# EAGLE design twilight3 (EAGLE 7.5.0)
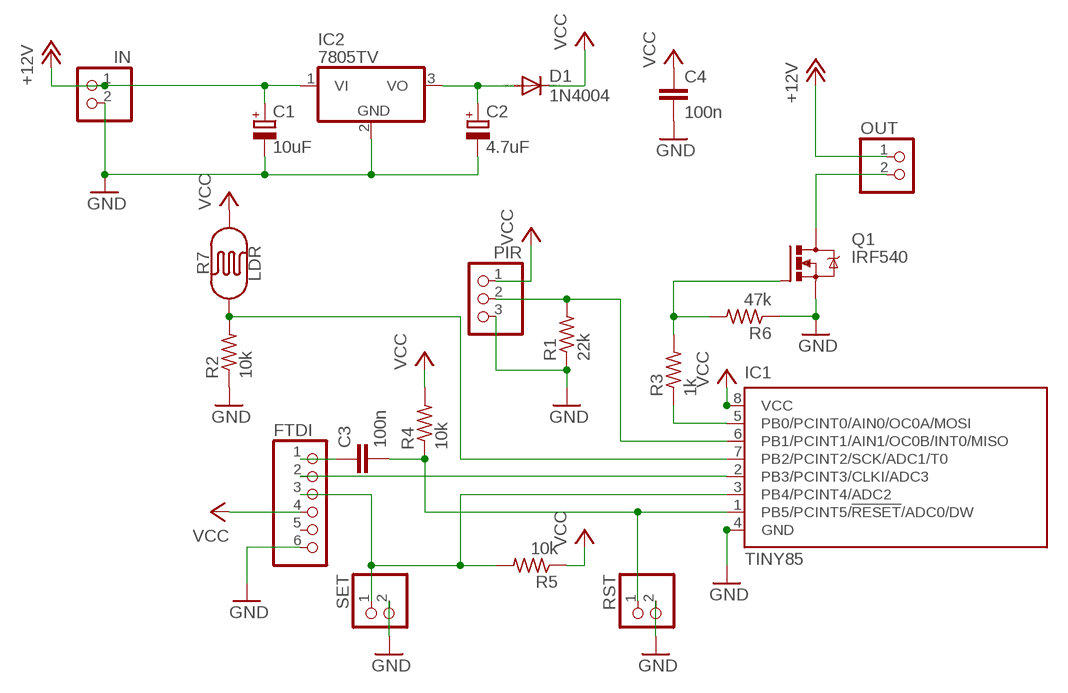
[diagram p0: schematic, sheet 1]

## Parts
C1  10uF  CPOL-EUE2-5  [E2-5]
C2  4.7uF  CPOL-EUE2-5  [E2-5]
C3  100n  C-EU050-024X044  [C050-024X044]
C4  100n  C-EU050-024X044  [C050-024X044]
D1  1N4004  [DO41-10]
FTDI  PINHD-1X6  [1X06]
IC1  TINY85  TINY13-20PU  [DIL08]
IC2  7805TV  [TO220V]
IN  PINHD-1X2  [1X02]
OUT  PINHD-1X2  [1X02]
PIR  PINHD-1X3  [1X03]
Q1  IRF540  [TO220BV]
R1  22k  R-US_0207/2V  [0207/2V]
R2  10k  R-US_0207/2V  [0207/2V]
R3  1k  R-US_0207/10  [0207/10]
R4  10k  R-US_0207/2V  [0207/2V]
R5  10k  R-US_0207/2V  [0207/2V]
R6  47k  R-US_0207/10  [0207/10]
R7  LDR  PHOTOCELLPTH  [PHOTOCELL]
RST  PINHD-1X2  [1X02]
SET  PINHD-1X2  [1X02]

## Nets
+12V: C1.+ IC2.1(VI) IN.1 OUT.1
GND: C1.- C2.- C4.2 FTDI.6 IC1.4(GND) IC2.2(GND) IN.2 PIR.3 Q1.S R1.1 R2.1 R6.1 RST.2 SET.2
GNDOUT: OUT.2 Q1.D
N$1: FTDI.2 IC1.2(PB3/PCINT3/CLKI/ADC3)
N$2: FTDI.3 IC1.3(PB4/PCINT4/ADC2) R5.2 SET.1
N$3: C3.2 IC1.1(PB5/PCINT5/!RESET!/ADC0/DW) R4.1 RST.1
N$4: IC1.7(PB2/PCINT2/SCK/ADC1/T0) R2.2 R7.1
N$5: IC1.5(PB0/PCINT0/AIN0/OC0A/MOSI) R3.1
N$6: Q1.G R3.2 R6.2
N$7: C3.1 FTDI.1
N$8: C2.+ D1.A IC2.3(VO)
N$9: IC1.6(PB1/PCINT1/AIN1/OC0B/INT0/MISO) PIR.2 R1.2
VCC: C4.1 D1.C FTDI.4 IC1.8(VCC) PIR.1 R4.2 R5.1 R7.2
Unconnected: FTDI.5

## Library data of the parts
C1 C2 = rcl:CPOL-EU: POLARIZED CAPACITOR, European symbol
C3 C4 = resistor:C-EU: CAPACITOR, European symbol
D1 = diode:1N4004: DIODE general purpose rectifier, 1 A
FTDI = pinhead:PINHD-1X6: PIN HEADER
IC1 = atmel:TINY13: 8-bit AVR Microcontroller with 1K Bytes In-System Programmable Flash Source: http://www.atmel.com/dyn/resources/prod_documents/2535S.pdf; MPN: ATTINY13-20PU; OC_FARNELL: 9171550; OC_NEWARK: 96K6521
IC2 = linear:78*: Positive VOLTAGE REGULATOR Source: http://cache.national.com/ds/LM/LM78L05.pdf http://www.fairchildsemi.com/ds/LM/LM7805.pdf
IN OUT RST SET = pinhead:PINHD-1X2: PIN HEADER
PIR = pinhead:PINHD-1X3: PIN HEADER
Q1 = transistor-power:IRF540: HEXFET Power MOSFET
R1-R6 = resistor:R-US_: RESISTOR, American symbol
R7 = SparkFun-Sensors:PHOTOCELL: Photocell (Photodetector, Photo Resistor, CdS) This is a very small light sensor. A photocell changes (also called a photodetector, photo resistor, CdS or photoconductive cell) resistance depending on the amount of light it is exposed to. These little sensors make great ambient light triggers (when light in the room turns on, do something). Datasheet <http://cdn.sparkfun.com/datasheets/Sensors/LightImaging/SEN-09088.pdf> SparkFun Products Mini Photocell <https://www.sparkfun.com/products/9088> (SEN-09088); PROD_ID: COMP-09129; SF_ID: SEN-09088

## Board
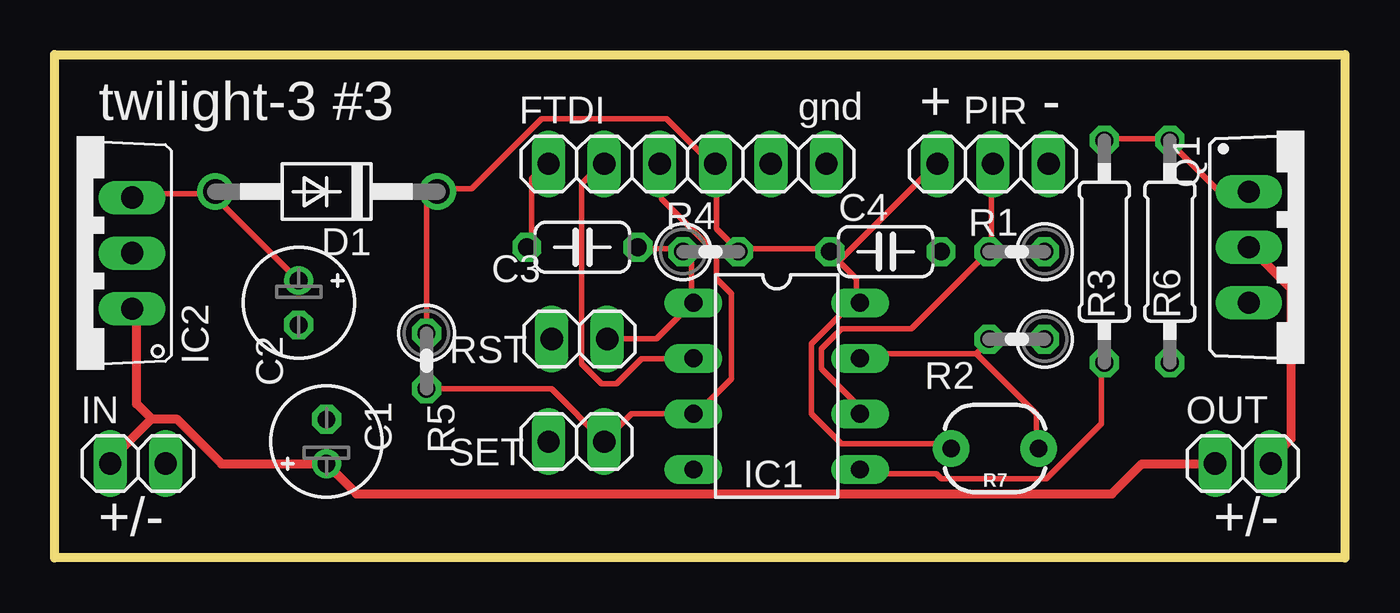
[diagram p1: board, top side]
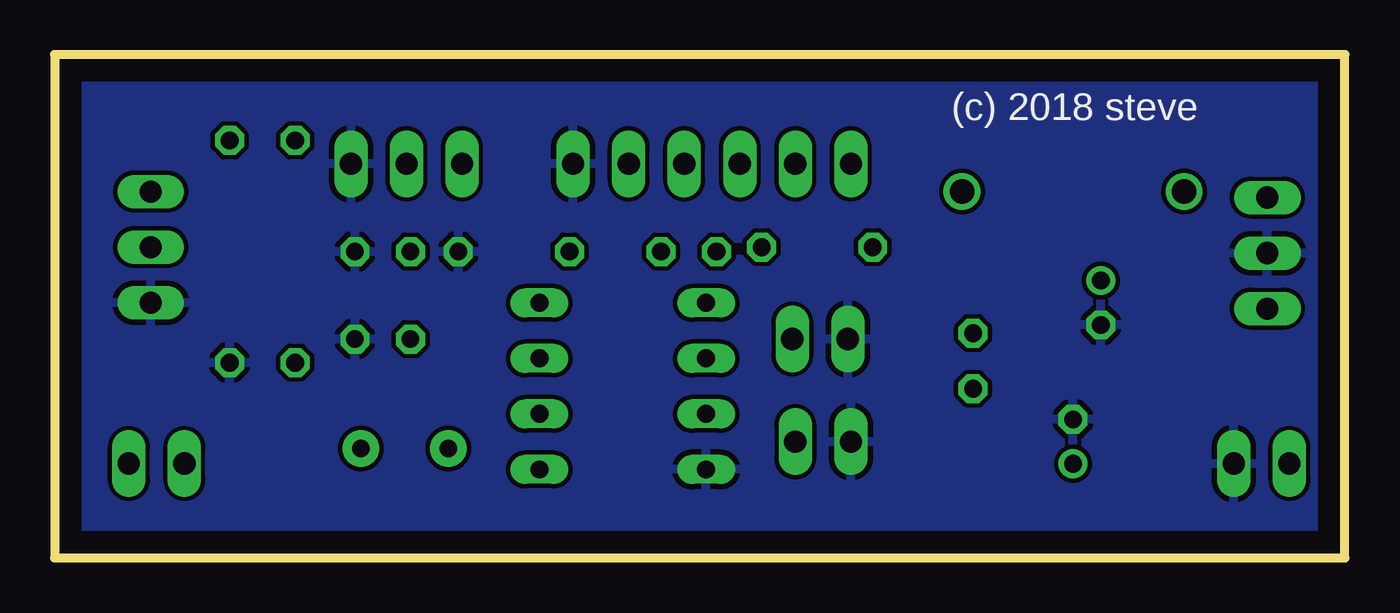
[diagram p2: board, bottom side, seen from below]

Size 59 x 23 mm. Coordinates in mm from the lower left corner, seen from the top.
Outline: 0,23 59,23 59,0 0,0 0,23
Copper layers (1*16): Top 0.035mm / dielectric 1.5mm / Bottom 0.035mm
Design rules "default": minimum track width 10mil, minimum drill 24mil, track to track 8mil, track to pad 8mil, pad to pad 8mil, via to via 8mil, smd to smd 8mil, copper to edge 40mil, drill to drill 8mil, minimum pad ring 10mil, minimum via ring 8mil, stop-mask expansion 4mil, vias tented up to drill 0mil, thermal gap 10mil

### Footprints (pad centres in the part's own frame; a part is rotated, then mirrored left to right if it is on the bottom)
E2-5 = drill 0.813 pad 1.27: + -1.016,0 | drill 0.813 pad 1.27 octagon: - 1.016,0
C050-024X044 = drill 0.813 octagon: 1 -2.54,0; 2 2.54,0
DO41-10 = drill 1.118: A 5.08,0; C -5.08,0
1X06 = drill 1.016 long: 1 -6.35,0; 2 -3.81,0; 3 -1.27,0; 4 1.27,0; 5 3.81,0; 6 6.35,0
DIL08 = drill 0.813 long: 1 -3.81,-3.81; 2 -1.27,-3.81; 3 1.27,-3.81; 4 3.81,-3.81; 5 3.81,3.81; 6 1.27,3.81; 7 -1.27,3.81; 8 -3.81,3.81
TO220V = drill 1.016 long: 1 -2.54,-2.54; 2 0,-2.54; 3 2.54,-2.54
1X02 = drill 1.016 long: 1 -1.27,0; 2 1.27,0
1X03 = drill 1.016 long: 1 -2.54,0; 2 0,0; 3 2.54,0
TO220BV = drill 1.016 long: D 0,-2.54; G -2.54,-2.54; S 2.54,-2.54
0207/2V = drill 0.813 octagon: 1 -1.27,0; 2 1.27,0
0207/10 = drill 0.813 octagon: 1 -5.08,0; 2 5.08,0
PHOTOCELL = drill 0.8 pad 1.676: 1 -2,0; 2 2,0

### Placement (x,y rotation side)
C1  12.43,5.31 90 top
C2  11.16,11.66 270 top
C3  24.13,14.2 0 top
C4  38,14 0 top
D1  12.43,16.74 180 top
FTDI  28.94,18.01 0 top
IC1  33.02,7.85 270 top
IC2  1,13.93 90 top
IN  3.81,4.31 0 top
OUT  54.34,4.31 0 top
PIR  42.91,18.01 0 top
Q1  57.15,14.2 270 top
R1  44,14 180 top
R2  44,10 180 top
R3  48,14 90 top
R4  30,14 0 top
R5  17,9 270 top
R6  51,14 90 top
R7  43,5 180 top
RST  24,10 180 top
SET  23.86,5.31 180 top

### Tracks (layer width: path | path; a pad name or v marks a point on that pad's centre or on a via)
+12V
  Top 0.254: 2.6,4.52 IN.1 | 3.74,11.38 IC2.1 | 52.89,4.29 OUT.1
  Top 0.406: 4.43,6.35 5.57,6.35 7.63,4.29 C1.+ 13.8,2.92 48.35,2.92 49.72,4.29 52.89,4.29 | 2.6,4.52 4.43,6.35 | 3.74,11.38 3.74,7.04 4.43,6.35
GND
  pour Bottom: 0,23 59,23 59,0 0,0
GNDOUT
  Top 0.254: 54.72,14.12 Q1.D | 55.63,4.52 OUT.2
  Top 0.406: 54.72,14.12 56.55,12.3 56.55,5.44 55.63,4.52
N$1
  Top 0.254: IC1.2 29.12,9.09 26.83,9.09 25.69,7.95 25,7.95 24.09,8.87 24.09,17.1 25,18.01 FTDI.2
N$2
  Top 0.254: R5.2 22.72,7.72 SET.1 25.23,5.44 26.38,6.58 IC1.3 29.35,6.58 30.95,8.18 30.95,12.07 30.26,12.75 30.26,13.89 27.75,16.41 27.75,18.01 FTDI.3
N$3
  Top 0.254: C3.2 26.83,14.12 28.66,14.12 R4.1 28.89,13.89 29.12,13.67 29.12,11.84 IC1.1 29.12,11.61 27.52,10.01 25.46,10.01 RST.1
N$4
  Top 0.254: 42.15,9.32 36.89,9.32 IC1.7 | 42.15,9.32 42.6,9.78 R2.2 | 42.15,9.32 44.89,6.58 44.89,5.21 R7.1
N$5
  Top 0.254: IC1.5 36.89,3.84 40.32,3.84 40.55,3.61 45.35,3.61 47.86,6.12 47.86,8.87 R3.1
N$6
  Top 0.254: R3.2 48.09,19.15 50.84,19.15 R6.2 51.06,18.92 53.12,16.87 54.49,16.87 Q1.G
N$7
  Top 0.254: C3.1 21.8,14.35 21.8,17.32 22.49,18.01 FTDI.1
N$8
  Top 0.254: 7.17,16.64 11.06,12.75 C2.+ | 7.17,16.64 3.74,16.64 IC2.3 | 7.17,16.64 D1.A
N$9
  Top 0.254: IC1.6 36.66,6.58 36.66,7.04 35.06,8.64 35.06,9.55 35.98,10.47 39.18,10.47 42.6,13.89 R1.2 42.83,14.12 42.83,18.01 PIR.2
VCC
  Top 0.254: R5.1 17,10.47 17,16.18 17.46,16.64 D1.C 17.69,16.87 19.06,16.87 22.26,20.07 27.98,20.07 30.03,18.01 FTDI.4 30.26,18.01 30.26,15.04 31.18,14.12 R4.2 31.4,14.12 35.29,14.12 C4.1 | 36.66,11.84 36.66,12.75 35.75,13.67 | 35.75,13.67 35.52,13.89 C4.1 | 35.75,13.67 35.98,13.67 40.32,18.01 PIR.1 | 35.75,13.67 C4.1 | 36.66,11.84 34.6,9.78 34.6,6.58 35.98,5.21 40.78,5.21 R7.2 | 36.66,11.84 IC1.8

### Text on the board
tPlace: twilight-3 #3 | gnd | + | - | +/- | +/-
bPlace: (c) 2018 steve